# EAGLE design serverleds (EAGLE 5.11)
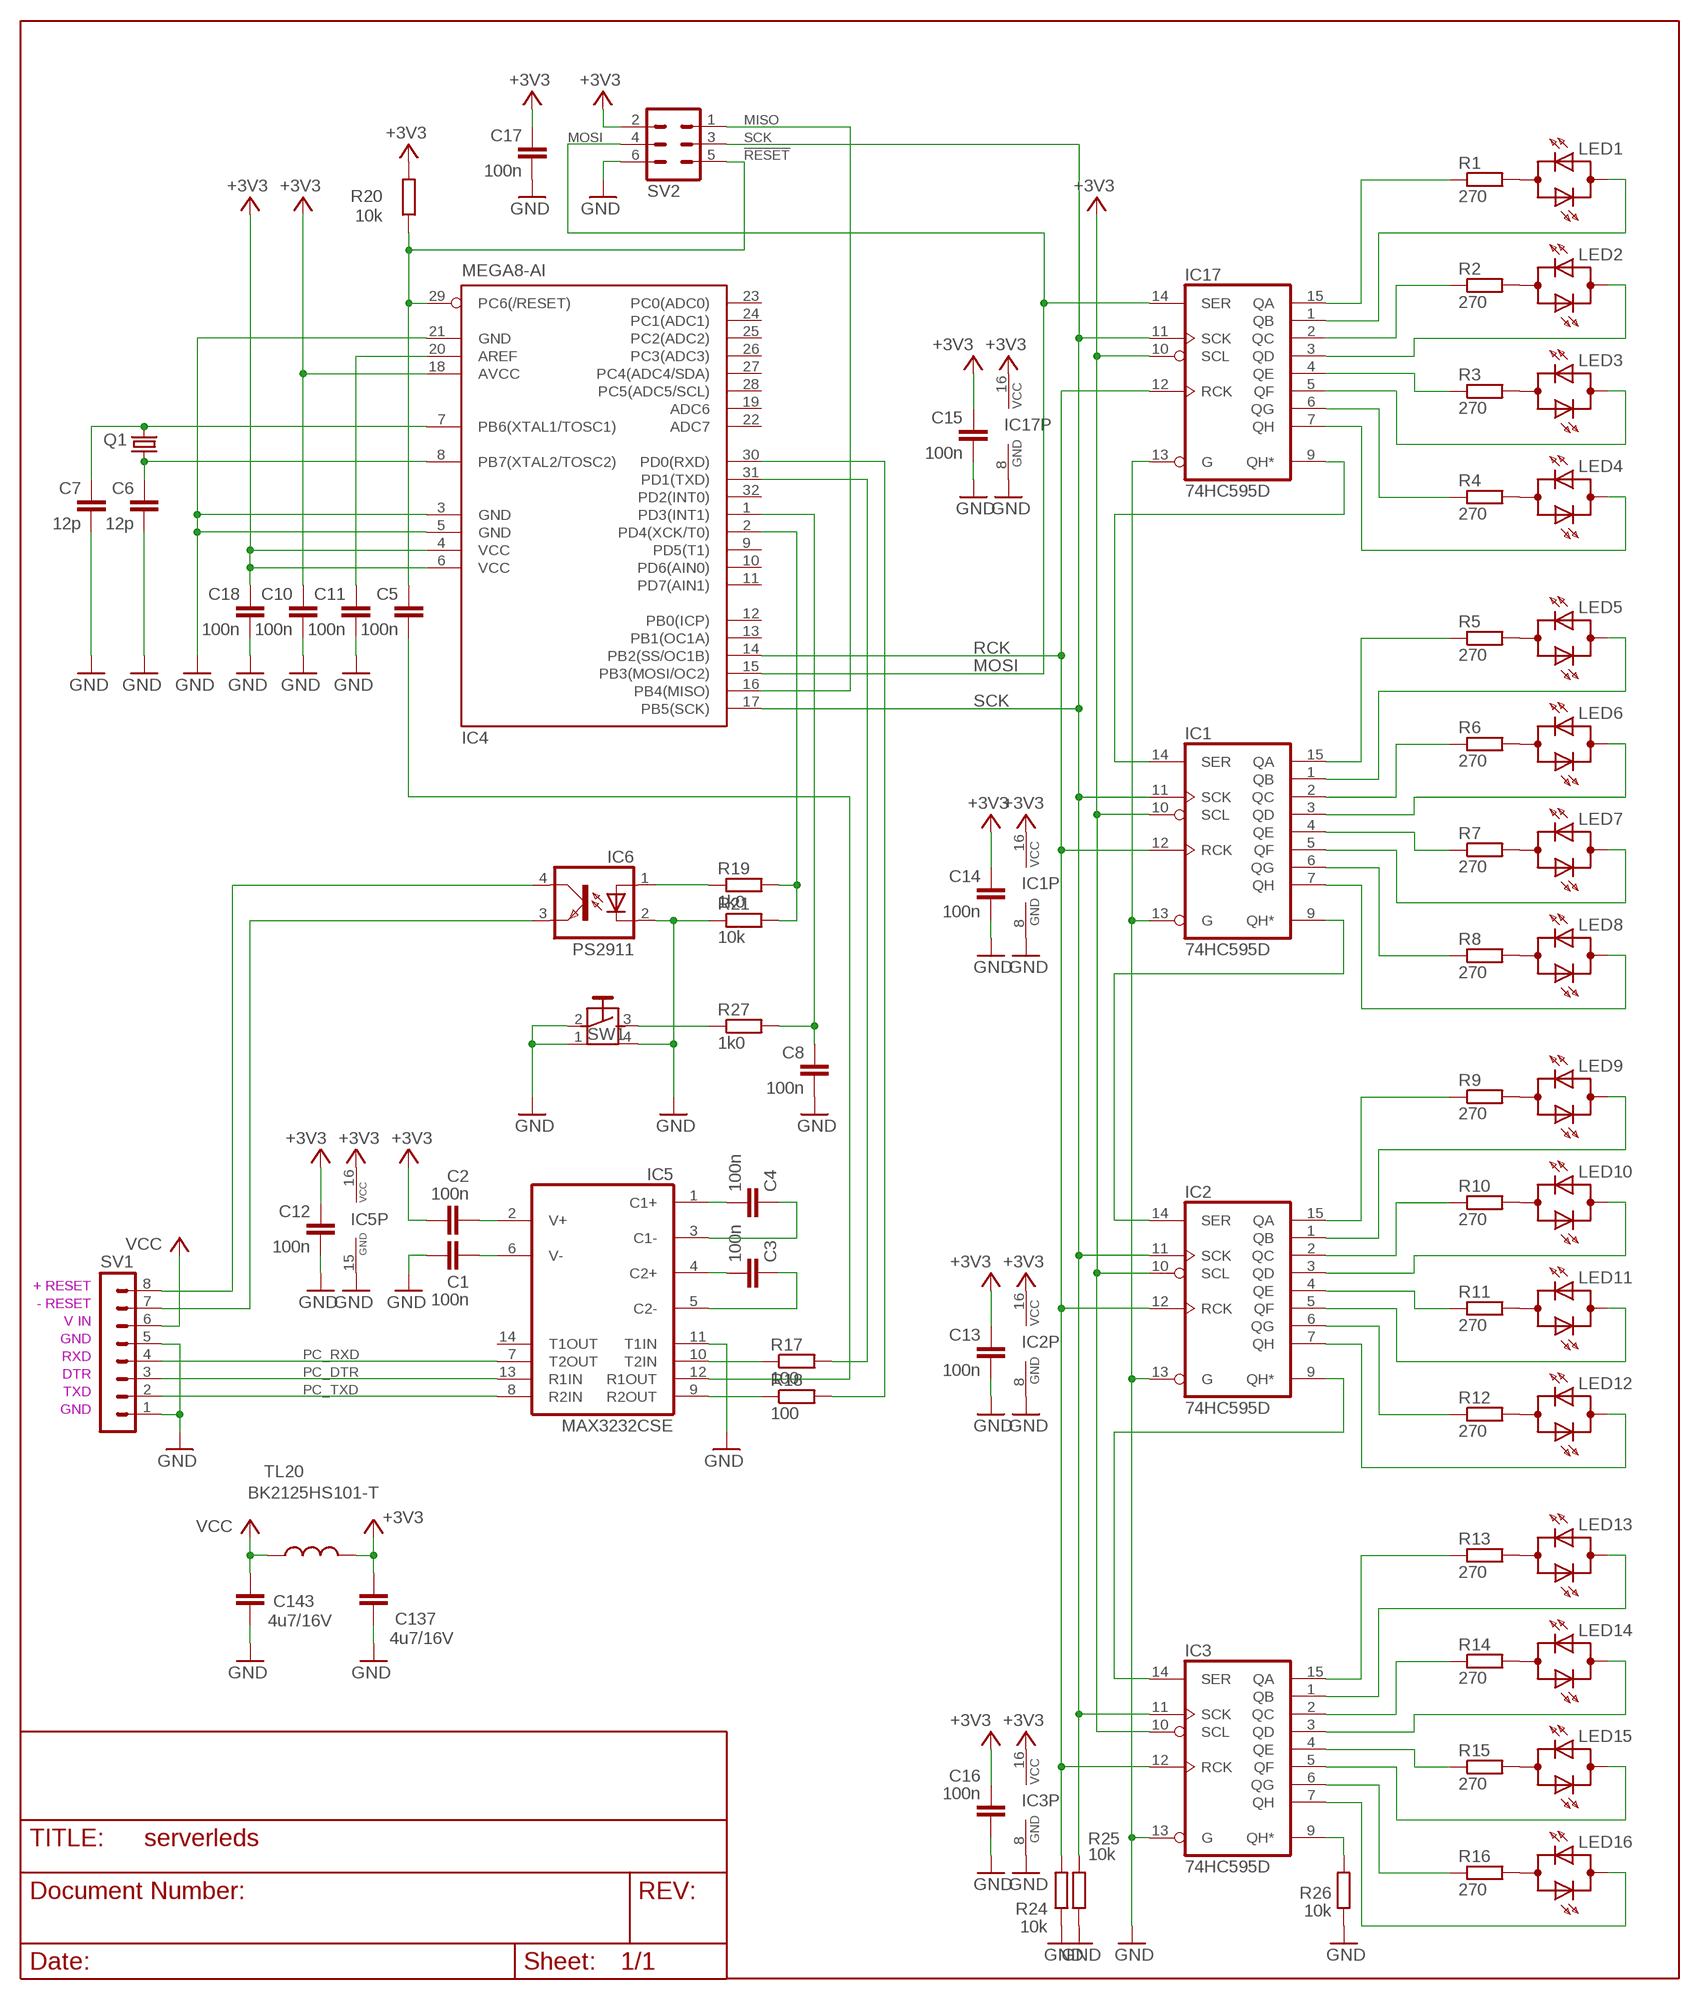
[diagram p0: schematic, sheet 1]

## Parts
C1  100n  C-EUC0805WF  [C0805WF]
C2  100n  C-EUC0805WF  [C0805WF]
C3  100n  C-EUC0805WF  [C0805WF]
C4  100n  C-EUC0805WF  [C0805WF]
C5  100n  C-EUC0805WF  [C0805WF]
C6  12p  C-EUC0805WF  [C0805WF]
C7  12p  C-EUC0805WF  [C0805WF]
C8  100n  C-EUC0805WF  [C0805WF]
C10  100n  C-EUC0805WF  [C0805WF]
C11  100n  C-EUC0805WF  [C0805WF]
C12  100n  C-EUC0805WF  [C0805WF]
C13  100n  C-EUC0805WF  [C0805WF]
C14  100n  C-EUC0805WF  [C0805WF]
C15  100n  C-EUC0805WF  [C0805WF]
C16  100n  C-EUC0805WF  [C0805WF]
C17  100n  C-EUC0805WF  [C0805WF]
C18  100n  C-EUC0805WF  [C0805WF]
C137  4u7/16V  C-EUC1206WF  [C1206WF]
C143  4u7/16V  C-EUC1206WF  [C1206WF]
IC1  74HC595D  [SO16]
IC2  74HC595D  [SO16]
IC3  74HC595D  [SO16]
IC4  MEGA8-AI  [TQFP32-08]
IC5  MAX3232CSE  [SO16]
IC6  PS2911  [PS2911]
IC17  74HC595D  [SO16]
LED1  DUO_2PINKRAJOVALED  [LED3_OKRAJ]
LED2  DUO_2PINKRAJOVALED  [LED3_OKRAJ]
LED3  DUO_2PINKRAJOVALED  [LED3_OKRAJ]
LED4  DUO_2PINKRAJOVALED  [LED3_OKRAJ]
LED5  DUO_2PINKRAJOVALED  [LED3_OKRAJ]
LED6  DUO_2PINKRAJOVALED  [LED3_OKRAJ]
LED7  DUO_2PINKRAJOVALED  [LED3_OKRAJ]
LED8  DUO_2PINKRAJOVALED  [LED3_OKRAJ]
LED9  DUO_2PINKRAJOVALED  [LED3_OKRAJ]
LED10  DUO_2PINKRAJOVALED  [LED3_OKRAJ]
LED11  DUO_2PINKRAJOVALED  [LED3_OKRAJ]
LED12  DUO_2PINKRAJOVALED  [LED3_OKRAJ]
LED13  DUO_2PINKRAJOVALED  [LED3_OKRAJ]
LED14  DUO_2PINKRAJOVALED  [LED3_OKRAJ]
LED15  DUO_2PINKRAJOVALED  [LED3_OKRAJ]
LED16  DUO_2PINKRAJOVALED  [LED3_OKRAJ]
Q1  HC49UP  [HC49UP]
R1  270  R-EU_R0805WF  [R0805WF]
R2  270  R-EU_R0805WF  [R0805WF]
R3  270  R-EU_R0805WF  [R0805WF]
R4  270  R-EU_R0805WF  [R0805WF]
R5  270  R-EU_R0805WF  [R0805WF]
R6  270  R-EU_R0805WF  [R0805WF]
R7  270  R-EU_R0805WF  [R0805WF]
R8  270  R-EU_R0805WF  [R0805WF]
R9  270  R-EU_R0805WF  [R0805WF]
R10  270  R-EU_R0805WF  [R0805WF]
R11  270  R-EU_R0805WF  [R0805WF]
R12  270  R-EU_R0805WF  [R0805WF]
R13  270  R-EU_R0805WF  [R0805WF]
R14  270  R-EU_R0805WF  [R0805WF]
R15  270  R-EU_R0805WF  [R0805WF]
R16  270  R-EU_R0805WF  [R0805WF]
R17  100  R-EU_R0805WF  [R0805WF]
R18  100  R-EU_R0805WF  [R0805WF]
R19  1k0  R-EU_R0805WF  [R0805WF]
R20  10k  R-EU_R0805WF  [R0805WF]
R21  10k  R-EU_R0805WF  [R0805WF]
R24  10k  R-EU_R0805WF  [R0805WF]
R25  10k  R-EU_R0805WF  [R0805WF]
R26  10k  R-EU_R0805WF  [R0805WF]
R27  1k0  R-EU_R0805WF  [R0805WF]
SV1  MA08-1  [MA08-1]
SV2  MA03-2  [MA03-2]
SW1  PHAP3305  [PHAP3305]
TL20  BK2125HS101-T  FERR_BOURNS_32610805R  [0805R]

## Nets
!RESET: C5.1 IC4.29(PC6(/RESET)) R20.1 SV2.5
+3V3: C2.2 C10.1 C12.1 C13.1 C14.1 C15.1 C16.1 C17.1 C18.1 C137.2 IC1.10(SCL) IC1.16(VCC) IC2.10(SCL) IC2.16(VCC) IC3.10(SCL) IC3.16(VCC) IC4.4(VCC) IC4.6(VCC) IC4.18(AVCC) IC5.16(VCC) IC17.10(SCL) IC17.16(VCC) R20.2 SV2.2 TL20.2
GND: C1.2 C6.2 C7.2 C8.2 C10.2 C11.2 C12.2 C13.2 C14.2 C15.2 C16.2 C17.2 C18.2 C137.1 C143.1 IC1.8(GND) IC1.13(G) IC2.8(GND) IC2.13(G) IC3.8(GND) IC3.13(G) IC4.3(GND) IC4.5(GND) IC4.21(GND) IC5.11(T1IN) IC5.15(GND) IC6.2(C) IC17.8(GND) IC17.13(G) R21.1 R24.1 R25.1 R26.1 SV1.1 SV1.5 SV2.6 SW1.1(G1) SW1.2(P) SW1.4(G2)
MISO: IC4.16(PB4(MISO)) SV2.1
MOSI: IC4.15(PB3(MOSI/OC2)) IC17.14(SER) SV2.4
N$1: LED1.A R1.2
N$2: LED2.A R2.2
N$3: LED3.A R3.2
N$4: LED4.A R4.2
N$5: LED5.A R5.2
N$6: LED6.A R6.2
N$7: LED7.A R7.2
N$8: LED8.A R8.2
N$9: IC17.1(QB) LED1.C
N$10: IC1.15(QA) R5.1
N$11: IC1.1(QB) LED5.C
N$12: IC1.2(QC) R6.1
N$13: IC1.3(QD) LED6.C
N$14: IC1.4(QE) R7.1
N$15: IC1.5(QF) LED7.C
N$16: IC1.6(QG) R8.1
N$17: IC1.7(QH) LED8.C
N$18: IC1.9(QH*) IC2.14(SER)
N$19: LED9.A R9.2
N$20: IC1.14(SER) IC17.9(QH*)
N$21: LED10.A R10.2
N$22: LED11.A R11.2
N$23: LED12.A R12.2
N$24: IC2.15(QA) R9.1
N$25: IC2.1(QB) LED9.C
N$26: IC2.2(QC) R10.1
N$27: IC2.3(QD) LED10.C
N$28: IC2.4(QE) R11.1
N$29: IC2.5(QF) LED11.C
N$30: IC2.6(QG) R12.1
N$31: IC2.7(QH) LED12.C
N$32: LED13.A R13.2
N$33: LED14.A R14.2
N$34: IC17.7(QH) LED4.C
N$35: LED15.A R15.2
N$36: LED16.A R16.2
N$37: IC3.15(QA) R13.1
N$38: IC3.1(QB) LED13.C
N$39: IC17.5(QF) LED3.C
N$40: IC17.6(QG) R4.1
N$41: IC3.2(QC) R14.1
N$42: IC3.3(QD) LED14.C
N$43: IC3.4(QE) R15.1
N$44: IC3.5(QF) LED15.C
N$45: IC3.6(QG) R16.1
N$46: IC3.7(QH) LED16.C
N$47: IC2.9(QH*) IC3.14(SER)
N$48: C2.1 IC5.2(V+)
N$49: C1.1 IC5.6(V-)
N$50: C4.2 IC5.1(C1+)
N$51: C3.2 IC5.4(C2+)
N$52: C4.1 IC5.3(C1-)
N$53: C3.1 IC5.5(C2-)
N$54: IC4.31(PD1(TXD)) R17.2
N$55: IC4.30(PD0(RXD)) R18.2
N$56: IC5.10(T2IN) R17.1
N$57: IC5.9(R2OUT) R18.1
N$58: IC6.1(A) R19.1
N$59: C5.2 IC5.12(R1OUT)
N$61: C6.1 IC4.8(PB7(XTAL2/TOSC2)) Q1.1
N$62: C7.1 IC4.7(PB6(XTAL1/TOSC1)) Q1.2
N$63: IC3.9(QH*) R26.2
N$67: IC17.2(QC) R2.1
N$68: IC17.3(QD) LED2.C
N$69: IC17.15(QA) R1.1
N$70: IC4.2(PD4(XCK/T0)) R19.2 R21.2
N$71: R27.1 SW1.3(S)
N$72: C8.1 IC4.1(PD3(INT1)) R27.2
N$73: C11.1 IC4.20(AREF)
N$74: IC6.3(E) SV1.7
N$75: IC6.4(COL) SV1.8
N$80: IC17.4(QE) R3.1
PC_DTR: IC5.13(R1IN) SV1.3
PC_RXD: IC5.7(T2OUT) SV1.4
PC_TXD: IC5.8(R2IN) SV1.2
RCK: IC1.12(RCK) IC2.12(RCK) IC3.12(RCK) IC4.14(PB2(SS/OC1B)) IC17.12(RCK) R24.2
SCK: IC1.11(SCK) IC2.11(SCK) IC3.11(SCK) IC4.17(PB5(SCK)) IC17.11(SCK) R25.2 SV2.3
VCC: C143.2 SV1.6 TL20.1
Unconnected: IC4.9(PD5(T1)) IC4.10(PD6(AIN0)) IC4.11(PD7(AIN1)) IC4.12(PB0(ICP)) IC4.13(PB1(OC1A)) IC4.19(ADC6) IC4.22(ADC7) IC4.23(PC0(ADC0)) IC4.24(PC1(ADC1)) IC4.25(PC2(ADC2)) IC4.26(PC3(ADC3)) IC4.27(PC4(ADC4/SDA)) IC4.28(PC5(ADC5/SCL)) IC4.32(PD2(INT0)) IC5.14(T1OUT)

## Notes on the sheet
- + RESET
- - RESET
- V IN
- GND
- RXD
- DTR
- TXD
- GND

## Library data of the parts
C1-C8 C10-C18 C137 C143 = rcl:C-EU: CAPACITOR, European symbol
IC1-IC3 IC17 = 74xx-eu:74*595: 8-bit SHIFT REGISTER, output latch
IC4 = atmel:MEGA8: MICROCONTROLLER 8 Kbytes FLASH, 1 kbytes SRAM, 512 bytes EEPROM, USART, 6-channel 10 bit ADC, 2-channel 8 bit ADC Pin compatible with Atmega48, ATMega88, ATMega168 Source: avr.lbr
IC5 = maxim:MAX3232*: True RS-232 Transceivers 3.0V to 5.5V, Low-Power up to 1Mbps, Using Four 0.1µF External Capacitors Source: http://pdfserv.maxim-ic.com/en/ds/MAX3222-MAX3241.pdf
IC6 = optocoupler:PS2911
LED1-LED16 = led:DUO_2PIN
Q1 = crystal:HC49UP: CRYSTAL
R1-R21 R24-R27 = rcl:R-EU_: RESISTOR, European symbol
SV1 = con-lstb:MA08-1: PIN HEADER
SV2 = con-lstb:MA03-2: PIN HEADER
SW1 = switch:PHAP3305
TL20 = 0joe1:FERR_BOURNS_3261

## Board
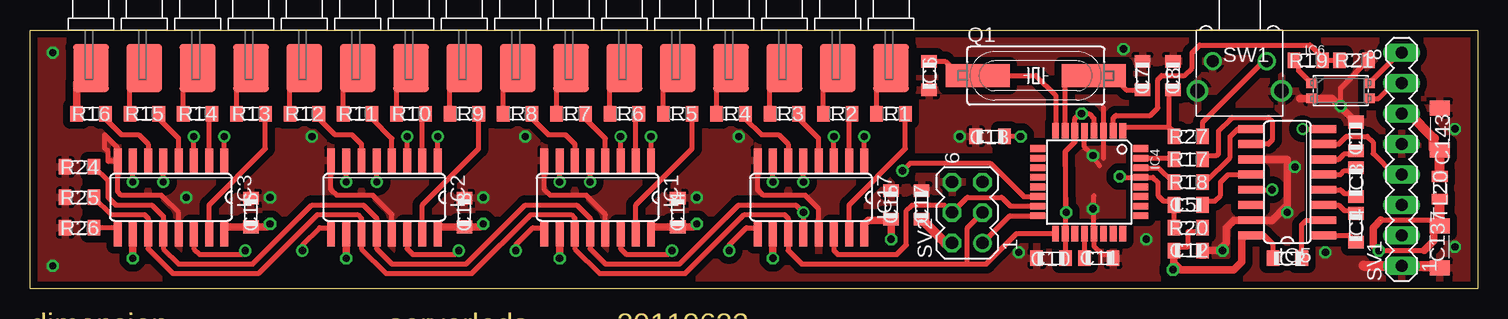
[diagram p1: board, top side]
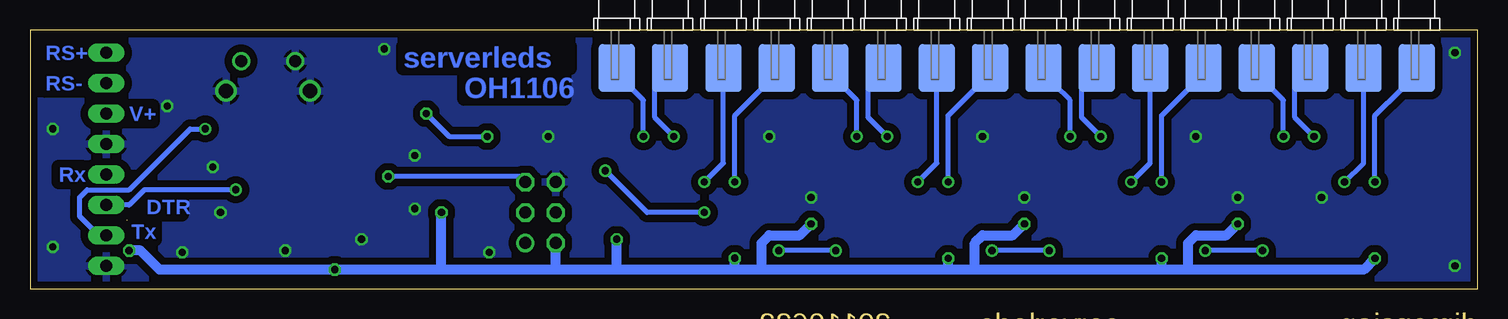
[diagram p2: board, bottom side, seen from below]

Size 120.65 x 21.59 mm. Coordinates in mm from the lower left corner, seen from the top.
Outline: 0,0 0,21.59 120.65,21.59 120.65,0 0,0
Copper layers (1*16): Top 0.035mm / dielectric 1.5mm / Bottom 0.035mm
Design rules "default *": minimum track width 0.2mm, minimum drill 0.6mm, track to track 0.2mm, track to pad 0.2mm, pad to pad 0.2mm, via to via 0.2mm, smd to smd 0.2mm, copper to edge 0.5mm, drill to drill 0.5mm, minimum pad ring 10mil, minimum via ring 8mil, stop-mask expansion 4mil, vias tented up to drill 0mil, thermal gap 10mil

### Footprints (pad centres in the part's own frame; a part is rotated, then mirrored left to right if it is on the bottom)
C0805WF = smd 1.05 x 1.3: 1 -1.2,0; 2 1.2,0
C1206WF = smd 1.25 x 1.7: 1 -1.75,0; 2 1.75,0
SO16 = smd 0.66 x 2.032: 1 -4.445,-3.073; 2 -3.175,-3.073; 3 -1.905,-3.073; 4 -0.635,-3.073; 5 0.635,-3.073; 6 1.905,-3.073; 7 3.175,-3.073; 8 4.445,-3.073; 9 4.445,3.073; 10 3.175,3.073; 11 1.905,3.073; 12 0.635,3.073; 13 -0.635,3.073; 14 -1.905,3.073; 15 -3.175,3.073; 16 -4.445,3.073
TQFP32-08 = smd 1.27 x 0.559: 1 -4.293,2.8; 2 -4.293,2; 3 -4.293,1.2; 4 -4.293,0.4; 5 -4.293,-0.4; 6 -4.293,-1.2; 7 -4.293,-2; 8 -4.293,-2.8; 17 4.293,-2.8; 18 4.293,-2; 19 4.293,-1.2; 20 4.293,-0.4; 21 4.293,0.4; 22 4.293,1.2; 23 4.293,2; 24 4.293,2.8 | smd 0.559 x 1.27: 9 -2.8,-4.293; 10 -2,-4.293; 11 -1.2,-4.293; 12 -0.4,-4.293; 13 0.4,-4.293; 14 1.2,-4.293; 15 2,-4.293; 16 2.8,-4.293; 25 2.8,4.293; 26 2,4.293; 27 1.2,4.293; 28 0.4,4.293; 29 -0.4,4.293; 30 -1.2,4.293; 31 -2,4.293; 32 -2.8,4.293
PS2911 = smd 0.8 x 0.8: 1 -2.45,0.635; 2 -2.45,-0.635; 3 2.45,-0.635; 4 2.45,0.635
LED3_OKRAJ = smd 4 x 3: A 3.175,0 | smd 4 x 3 bottom: C 3.175,0
HC49UP = smd 5.334 x 1.93: 1 -4.826,0; 2 4.826,0
R0805WF = smd 1.05 x 1.3: 1 -1.2,0; 2 1.2,0
MA08-1 = drill 1.016 long: 1 -8.89,0; 2 -6.35,0; 3 -3.81,0; 4 -1.27,0; 5 1.27,0; 6 3.81,0; 7 6.35,0; 8 8.89,0
MA03-2 = drill 1.016 round: 1 -2.54,-1.27 | drill 1.016 octagon: 2 -2.54,1.27; 3 0,-1.27; 4 0,1.27; 5 2.54,-1.27; 6 2.54,1.27
PHAP3305 = drill 1.2 round: 1 3.5,5.1; 4 -3.5,5.1 | drill 1 round: 2 2.25,2.6; 3 -2.25,2.6
0805R = smd 0.9 x 1.3: 1 -0.95,0; 2 0.95,0

### Placement (x,y rotation side)
C1  110.49,12.7 90 top
C2  104.78,2.54 180 top
C3  110.49,8.89 270 top
C4  110.49,5.08 270 top
C5  96.52,6.99 0 top
C6  74.93,17.78 270 top
C7  92.71,17.78 90 top
C8  95.25,17.78 90 top
C10  85.09,2.54 180 top
C11  89.06,2.54 0 top
C12  96.52,3.17 0 top
C13  36.2,6.35 90 top
C14  53.98,6.35 90 top
C15  71.75,6.99 90 top
C16  18.41,6.35 90 top
C17  74.3,6.99 90 top
C18  80.01,12.7 180 top
C137  117.47,3.49 90 top
C143  117.47,13.34 270 top
IC1  47.31,7.62 180 top
IC2  29.53,7.62 180 top
IC3  11.75,7.62 180 top
IC4  88.27,8.89 270 top
IC5  104.78,8.89 90 top
IC6  109.22,16.51 0 top
IC17  65.09,7.62 180 top
LED1  71.75,21.59 270 top
LED2  67.31,21.59 270 top
LED3  62.87,21.59 270 top
LED4  58.42,21.59 270 top
LED5  53.98,21.59 270 top
LED6  49.53,21.59 270 top
LED7  45.09,21.59 270 top
LED8  40.64,21.59 270 top
LED9  36.2,21.59 270 top
LED10  31.75,21.59 270 top
LED11  27.3,21.59 270 top
LED12  22.86,21.59 270 top
LED13  18.41,21.59 270 top
LED14  13.97,21.59 270 top
LED15  9.53,21.59 270 top
LED16  5.08,21.59 270 top
Q1  83.82,17.78 0 top
R1  71.75,14.61 180 top
R2  67.31,14.61 180 top
R3  62.87,14.61 180 top
R4  58.42,14.61 180 top
R5  53.98,14.61 180 top
R6  49.53,14.61 180 top
R7  45.09,14.61 180 top
R8  40.64,14.61 180 top
R9  36.2,14.61 180 top
R10  31.75,14.61 180 top
R11  27.3,14.61 180 top
R12  22.86,14.61 180 top
R13  18.41,14.61 180 top
R14  13.97,14.61 180 top
R15  9.53,14.61 180 top
R16  5.08,14.61 180 top
R17  96.52,10.79 180 top
R18  96.52,8.89 180 top
R19  106.52,19.05 0 top
R20  96.52,5.08 0 top
R21  110.33,19.05 180 top
R24  4.13,10.16 0 top
R25  4.13,7.62 0 top
R26  4.13,5.08 0 top
R27  96.52,12.7 180 top
SV1  114.3,10.79 90 top
SV2  78.11,6.35 90 top
SW1  100.81,21.59 180 top
TL20  117.47,8.41 270 top

### Tracks (layer width: path | path; a pad name or v marks a point on that pad's centre or on a via)
!RESET  (via drill 0.6)
  Top 0.406: R20.1 C5.1 95.09,7.21 95.09,7.3 94.46,7.3 93.98,7.78 93.98,8.89 93.58,9.29 IC4.29 90.88,9.29 v90.81,9.37
  Bottom 0.406: v90.81,9.37 79.85,9.37 SV2.5
+3V3  (via drill 0.6)  (1 unrouted)
  Top 0.406: C10.1 86.27,2.56 IC4.18 86.27,11.43 | C2.2 103.58,3.74 102.87,4.45 IC5.16 | C12.1 95.32,3.25 95.57,3.49 96.52,3.49 96.52,4.76 97.79,4.76 97.79,5.08 R20.2 | IC4.4 88.67,14.21 88.27,14.61 v87.63,14.61 87.47,14.61 87.06,14.2 IC4.6 87.06,12.23 86.27,11.43 | v82.55,12.7 C18.1 | v86.36,6.35 86.27,11.43 | v112.39,3.17 116.2,3.17 | 117.47,5.71 112.55,5.71
  Top 0.61: 95.32,2.15 95.32,3.25 | 95.32,2.15 95.89,1.59 100.33,1.59 100.97,2.22 100.97,4.13 101.28,4.45 IC5.16 | IC17.16 69.53,5.4 69.85,5.71 71.69,5.71 C15.1 v71.75,4.13 | v61.91,2.54 IC17.10 | v55.56,5.4 55.31,5.15 C14.1 51.75,5.15 IC1.16 | v44.13,2.54 IC1.10 | v37.78,5.4 37.53,5.15 C13.1 33.97,5.15 IC2.16 | v26.35,2.54 IC2.10 | v20,5.4 19.75,5.15 C16.1 16.19,5.15 IC3.16 | v8.57,2.54 IC3.10 | C137.2 117.15,4.92 117,4.92 117,3.97 116.2,3.17 | 95.32,2.15 95.32,1.59 v95.25,1.59 | v112.39,3.17 112.08,3.49 111.92,3.65 111.92,5.08 112.55,5.71
  Top 0.813: C137.2 117.47,5.71 TL20.2 | C17.1 76.27,3.81 SV2.2
  Bottom 0.406: v82.55,12.7 85.72,12.7 v87.63,14.61
  Bottom 0.813: v112.39,3.17 111.44,3.17 109.86,1.59 v95.25,1.59 | 24.13,1.59 9.53,1.59 v8.57,2.54 | 26.35,1.59 41.91,1.59 | 44.13,1.59 59.69,1.59 | 61.91,1.59 71.75,1.59 | 76.68,1.59 76.83,1.59 | 76.83,1.59 86.36,1.59 | v20,5.4 20.95,4.45 23.5,4.45 24.13,3.81 24.13,1.59 | 24.13,1.59 26.35,1.59 | 26.35,1.59 v26.35,2.54 | v37.78,5.4 38.73,4.45 41.27,4.45 41.91,3.81 41.91,1.59 | 41.91,1.59 44.13,1.59 | 44.13,1.59 v44.13,2.54 | v55.56,5.4 56.52,4.45 59.05,4.45 59.69,3.81 59.69,1.59 | 59.69,1.59 61.91,1.59 | 61.91,1.59 v61.91,2.54 | 76.83,1.59 76.83,1.75 | 76.83,1.75 SV2.2 | 76.68,1.59 76.83,1.75 | 71.75,1.59 76.68,1.59 | 71.75,1.59 v71.75,4.13 | v95.25,1.59 | 86.36,1.59 v95.25,1.59 | 86.36,1.59 v86.36,6.35
GND  (via drill 0.6)
  Top 0.406: 89.47,10.88 IC4.3 89.47,15.09 | 89.14,10.24 88.27,11.43 87.86,11.83 IC4.5 | C11.2 90.01,2.79 90.01,2.86 89.38,2.86 88.67,3.57 IC4.21 | 88.67,4.84 88.67,7.77 | IC17.13 65.72,6.67 64.61,7.78 61.12,7.78 60.64,8.26 IC17.8 | IC1.13 47.94,6.19 46.35,7.78 43.34,7.78 42.86,8.26 IC1.8 | IC2.13 30.16,6.19 28.57,7.78 25.56,7.78 25.08,8.26 IC2.8 | IC3.13 12.38,6.35 11.11,7.62 | 11.11,7.62 | 11.11,7.62 10.95,7.78 7.62,7.78 7.3,8.1 7.3,10.64 | 7.3,10.64 IC3.8 7.3,11.75 6.19,12.86 6.19,11.75 6.51,11.43 6.51,10.64 7.3,10.64 | R21.1 109.22,16.74 v109.22,15.24
  Top 0.61: C12.2 99.06,3.17 99.69,3.81 99.69,5.08 100.33,5.71 IC5.15 103.5,5.71 104.78,6.99 104.78,10.79 IC5.11 | C1.2 108.52,15.88 IC6.2 105.82,15.88
  Top 0.813: SV1.1 117,1.91 C137.1 | 111.12,1.91 SV1.1
  other vias: 82.39,3.02 93.03,4.13 88.58,6.67 88.58,11.11 77.47,12.7 91.12,20 118.75,13.34 118.75,3.49 99.38,3.18 55.56,7.62 59.06,12.7 37.78,7.62 41.28,12.7 20,7.62 23.5,12.7 13.02,7.62 1.91,1.91 1.91,19.69 104.78,6.35 105.41,10.16 107.95,3.02
  pour Top (isolate 0.61): 0,21.59 0,0 120.65,0 120.65,21.59
  pour Bottom (isolate 0.61): 0,21.59 0,0 120.65,0 120.65,21.59
MISO
  Top 0.406: IC4.16 81.66,6.09 SV2.1
MOSI
  Top 0.406: IC4.15 81.69,6.89 80.96,7.62 78.11,7.62 SV2.4 76.68,6.51 76.2,6.99 73.5,6.99 73.03,6.51 73.03,3.65 72.23,2.86 67.31,2.86 66.99,3.17 IC17.14
N$1
  Top 0.406: R1.2 70.56,18.41 LED1.A
N$2
  Top 0.406: R2.2 66.11,18.41 LED2.A
N$3
  Top 0.406: R3.2 61.66,18.41 LED3.A
N$4
  Top 0.406: R4.2 57.22,18.41 LED4.A
N$5
  Top 0.406: R5.2 52.77,18.41 LED5.A
N$6
  Top 0.406: R6.2 48.33,18.41 LED6.A
N$7
  Top 0.406: R7.2 43.88,18.41 LED7.A
N$8
  Top 0.406: R8.2 39.44,18.41 LED8.A
N$9  (via drill 0.6)
  Top 0.406: IC17.1 v69.53,12.7
  Bottom 0.406: v69.53,12.7 69.53,15.72 70.8,16.99 70.8,17.46 LED1.C
N$10
  Top 0.406: R5.1 55.17,11.68 50.48,6.99 IC1.15
N$11  (via drill 0.6)
  Top 0.406: IC1.1 v51.75,12.7
  Bottom 0.406: v51.75,12.7 51.75,15.72 53.02,16.99 53.02,17.46 LED5.C
N$12
  Top 0.406: IC1.2 50.48,14.61 R6.1
N$13  (via drill 0.6)
  Top 0.406: IC1.3 v49.21,12.7
  Bottom 0.406: v49.21,12.7 50.8,14.29 50.8,18.41 LED6.C
N$14
  Top 0.406: IC1.4 47.94,12.54 46.28,14.2 R7.1
N$15  (via drill 0.6)
  Top 0.406: v46.67,8.89 IC1.5
  Bottom 0.406: v46.67,8.89 45.09,10.48 LED7.C
N$16
  Top 0.406: IC1.6 45.4,12.06 44.61,12.86 43.18,12.86 41.84,14.2 R8.1
N$17  (via drill 0.6)
  Top 0.406: v44.13,8.89 IC1.7
  Bottom 0.406: v44.13,8.89 44.13,14.45 41.91,16.67 LED8.C
N$18  (via drill 0.6)
  Top 0.406: IC2.14 31.43,3.33 31.91,2.86 35.4,2.86 v35.72,3.17 | v40.48,3.17 40.48,3.65 41.91,5.08 42.86,5.08 IC1.9
  Bottom 0.406: v35.72,3.17 v40.48,3.17
N$19
  Top 0.406: R9.2 34.99,18.41 LED9.A
N$20  (via drill 0.6)
  Top 0.406: IC1.14 49.21,3.33 49.69,2.86 53.18,2.86 v53.5,3.17 | v58.26,3.17 58.26,3.65 59.69,5.08 60.64,5.08 IC17.9
  Bottom 0.406: v53.5,3.17 v58.26,3.17
N$21
  Top 0.406: R10.2 30.55,18.41 LED10.A
N$22
  Top 0.406: R11.2 26.11,18.41 LED11.A
N$23
  Top 0.406: R12.2 21.66,18.41 LED12.A
N$24
  Top 0.406: R9.1 37.4,11.68 32.7,6.99 IC2.15
N$25  (via drill 0.6)
  Top 0.406: IC2.1 v33.97,12.7
  Bottom 0.406: v33.97,12.7 33.97,15.72 35.24,16.99 35.24,17.46 LED9.C
N$26
  Top 0.406: IC2.2 32.7,14.61 R10.1
N$27  (via drill 0.6)
  Top 0.406: IC2.3 v31.43,12.7
  Bottom 0.406: v31.43,12.7 33.02,14.29 33.02,18.41 LED10.C
N$28
  Top 0.406: IC2.4 30.16,12.54 28.5,14.2 R11.1
N$29  (via drill 0.6)
  Top 0.406: v28.89,8.89 IC2.5
  Bottom 0.406: v28.89,8.89 27.3,10.48 LED11.C
N$30
  Top 0.406: IC2.6 27.62,12.06 26.83,12.86 25.4,12.86 24.13,14.13 24.13,14.54 R12.1
N$31  (via drill 0.6)
  Top 0.406: v26.35,8.89 IC2.7
  Bottom 0.406: v26.35,8.89 26.35,14.45 23.97,16.83 LED12.C
N$32
  Top 0.406: R13.2 17.21,17.21 LED13.A
N$33
  Top 0.406: R14.2 12.77,17.21 LED14.A
N$34  (via drill 0.6)
  Top 0.406: v61.91,8.89 IC17.7
  Bottom 0.406: v61.91,8.89 61.91,14.45 58.42,17.94 LED4.C
N$35
  Top 0.406: R15.2 8.32,18.41 LED15.A
N$36
  Top 0.61: R16.2 3.88,17.21 LED16.A
N$37
  Top 0.406: IC3.15 14.92,6.99 19.61,11.68 R13.1
N$38  (via drill 0.6)
  Top 0.406: IC3.1 v16.19,12.7
  Bottom 0.406: v16.19,12.7 16.19,15.72 17.14,16.67 17.14,17.14 LED13.C
N$39  (via drill 0.6)
  Top 0.406: v64.45,8.89 IC17.5
  Bottom 0.406: v64.45,8.89 62.87,10.48 LED3.C
N$40
  Top 0.406: IC17.6 63.18,12.06 62.39,12.86 60.96,12.86 59.62,14.2 R4.1
N$41
  Top 0.406: IC3.2 14.92,14.36 R14.1
N$42  (via drill 0.6)
  Top 0.406: IC3.3 v13.65,12.7
  Bottom 0.406: 13.65,18.41 LED14.C 14.61,18.41 15.24,17.78 15.24,14.29 v13.65,12.7
N$43
  Top 0.406: IC3.4 12.38,12.54 10.72,14.2 R15.1
N$44  (via drill 0.6)
  Top 0.406: v11.11,8.89 IC3.5
  Bottom 0.406: v11.11,8.89 9.53,10.48 LED15.C
N$45
  Top 0.406: IC3.6 9.84,12.06 9.05,12.86 7.62,12.86 6.28,14.2 R16.1
N$46  (via drill 0.6)
  Top 0.406: v8.57,8.89 IC3.7
  Bottom 0.406: v8.57,8.89 8.57,14.45 6.35,16.67 6.35,17.14 LED16.C
N$47  (via drill 0.6)
  Top 0.406: IC3.14 13.65,3.33 14.13,2.86 17.62,2.86 v17.94,3.17 | v22.7,3.17 22.7,3.65 24.13,5.08 25.08,5.08 IC2.9
  Bottom 0.406: v17.94,3.17 v22.7,3.17
N$48
  Top 0.406: C2.1 105.97,5.33 106.36,5.71 IC5.2
N$49
  Top 0.406: IC5.6 109.06,10.79 109.38,11.11 | 109.38,11.11 | 109.38,11.11 109.54,11.27 110.26,11.27 C1.1
N$50
  Top 0.406: IC5.1 109.92,4.45 C4.2
N$51
  Top 0.406: IC5.4 109.22,8.26 109.54,7.94 110.24,7.94 C3.2
N$52
  Top 0.406: IC5.3 109.06,6.99 109.54,6.51 110.26,6.51 C4.1
N$53
  Top 0.406: IC5.5 109.22,9.53 109.54,9.84 110.24,9.84 C3.1
N$54
  Top 0.406: IC4.31 95.22,10.89 arc-90 R17.2
N$55
  Top 0.406: IC4.30 94.05,10.09 95.25,8.89 R18.2
N$56
  Top 0.406: R17.1 97.95,11.02 97.95,11.11 98.9,11.11 99.06,11.27 99.06,13.18 100.01,14.13 | 100.01,14.13 | 100.01,14.13 100.17,14.29 103.19,14.29 103.5,13.97 103.5,12.38 103.19,12.06 IC5.10
N$57
  Top 0.406: R18.1 97.95,8.89 100.01,10.95 100.01,12.7 100.65,13.34 IC5.9
N$58
  Top 0.406: R19.1 105.73,18.89 105.73,18.19 105.82,18.1 IC6.1
N$59
  Top 0.406: IC5.12 99.85,9.53 99.22,8.89 99.22,7.78 98.74,7.3 98.04,7.3 C5.2
N$61
  Top 0.406: IC4.8 85.47,16.14 83.82,17.78 Q1.1 77.47,17.78 76.27,18.98 C6.1
N$62
  Top 0.406: IC4.7 86.27,17.68 86.36,17.78 Q1.2 90.17,17.78 91.37,16.58 C7.1
N$63
  Top 0.406: IC3.9 7.3,5.08 R26.2
N$67
  Top 0.406: IC17.2 68.26,14.61 R2.1
N$68  (via drill 0.6)
  Top 0.406: IC17.3 v66.99,12.7
  Bottom 0.406: v66.99,12.7 68.58,14.29 68.58,17.78 67.94,18.41 LED2.C
N$69
  Top 0.406: R1.1 72.95,11.68 68.26,6.99 IC17.15
N$70
  Top 0.406: IC4.2 90.27,14.22 90.49,14.45 93.34,14.45 93.98,15.08 93.98,17.46 94.3,17.78 96.2,17.78 96.84,18.41 96.84,19.68 97.47,20.32 106.68,20.32 107.95,19.05 R19.2 108.67,19.05 108.9,19.28 R21.2
N$71
  Top 0.406: R27.1 97.72,13.9 102.81,18.99 SW1.3
N$72
  Top 0.406: 94.93,13.49 94.93,16.58 C8.1 | IC4.1 91.06,13.6 91.12,13.49 94.93,13.49 | R27.2 95.32,12.79 95.25,13.18 | 94.93,13.49 95.25,13.18 | 95.25,13.18 95.09,13.02
N$73
  Top 0.406: C11.1 IC4.20
N$74
  Top 0.406: SV1.7 113.67,17.14 112.39,15.88 IC6.3
N$75
  Top 0.406: IC6.4 111.76,17.23 111.76,17.3 113.98,19.53 SV1.8
N$80
  Top 0.406: IC17.4 65.72,12.54 64.06,14.2 R3.1
PC_DTR  (via drill 0.6)
  Top 0.406: IC5.13 v103.5,8.26
  Bottom 0.406: v103.5,8.26 111.12,8.26 112.39,6.99 SV1.3
PC_RXD
  Top 0.406: IC5.7 109.06,12.06 109.7,12.7 111.44,12.7 111.92,12.22 111.92,11.27 113.67,9.53 SV1.4
PC_TXD  (via drill 0.6)
  Top 0.406: v106.05,13.34 IC5.8
  Bottom 0.406: v106.05,13.34 107.31,13.34 112.39,8.26 115.89,8.26 116.52,7.62 116.52,6.03 114.94,4.45 SV1.2
RCK  (via drill 0.6)
  Top 0.406: IC17.12 v64.45,6.35 63.82,6.99 59.05,6.99 54.13,2.06 47.94,2.06 46.67,3.33 IC1.12 46.67,5.87 45.56,6.99 45.24,6.99 41.27,6.99 36.35,2.06 30.16,2.06 28.89,3.33 IC2.12 28.89,5.87 27.78,6.99 23.5,6.99 18.57,2.06 12.38,2.06 11.11,3.33 IC3.12 11.11,6.03 10.16,6.99 7.14,6.99 6.51,7.62 6.51,8.98 R24.2 | v72.71,9.84 73.34,10.48 80.01,10.48 82.8,7.69 IC4.14
  Bottom 0.406: v64.45,6.35 69.22,6.35 v72.71,9.84
SCK
  Top 0.406: R25.2 6.76,6.19 9.53,6.19 9.84,5.87 IC3.11 9.84,3.33 11.91,1.27 19.05,1.27 23.97,6.19 27.3,6.19 27.62,5.87 IC2.11 27.62,3.33 29.69,1.27 36.83,1.27 41.75,6.19 45.09,6.19 45.4,5.87 IC1.11 45.4,3.33 47.47,1.27 54.61,1.27 59.53,6.19 62.87,6.19 63.18,5.87 IC17.11 63.18,3.17 64.29,2.06 78.11,2.06 | IC4.17 82.23,4.6 79.69,2.06 78.11,2.06 | 78.11,2.06 78.11,5.08 SV2.3
VCC
  Top 0.406: 114.94,14.61 SV1.6
  Top 0.813: 114.94,14.61 117,12.54 117,11.59 C143.2 TL20.1

### Text on the board
Top: top | 20110622
Bottom: RS+ | RS- | OH1106 | V+ | Rx | DTR | Tx | bottom | 20110622
Unrouted: 120.65 | 21.6
Dimension: dimension | 20110622
tStop: top_solder_stop | 20110622
bStop: bottom_solder_stop | 20110622